# EAGLE design untitled (EAGLE 6.5.0)
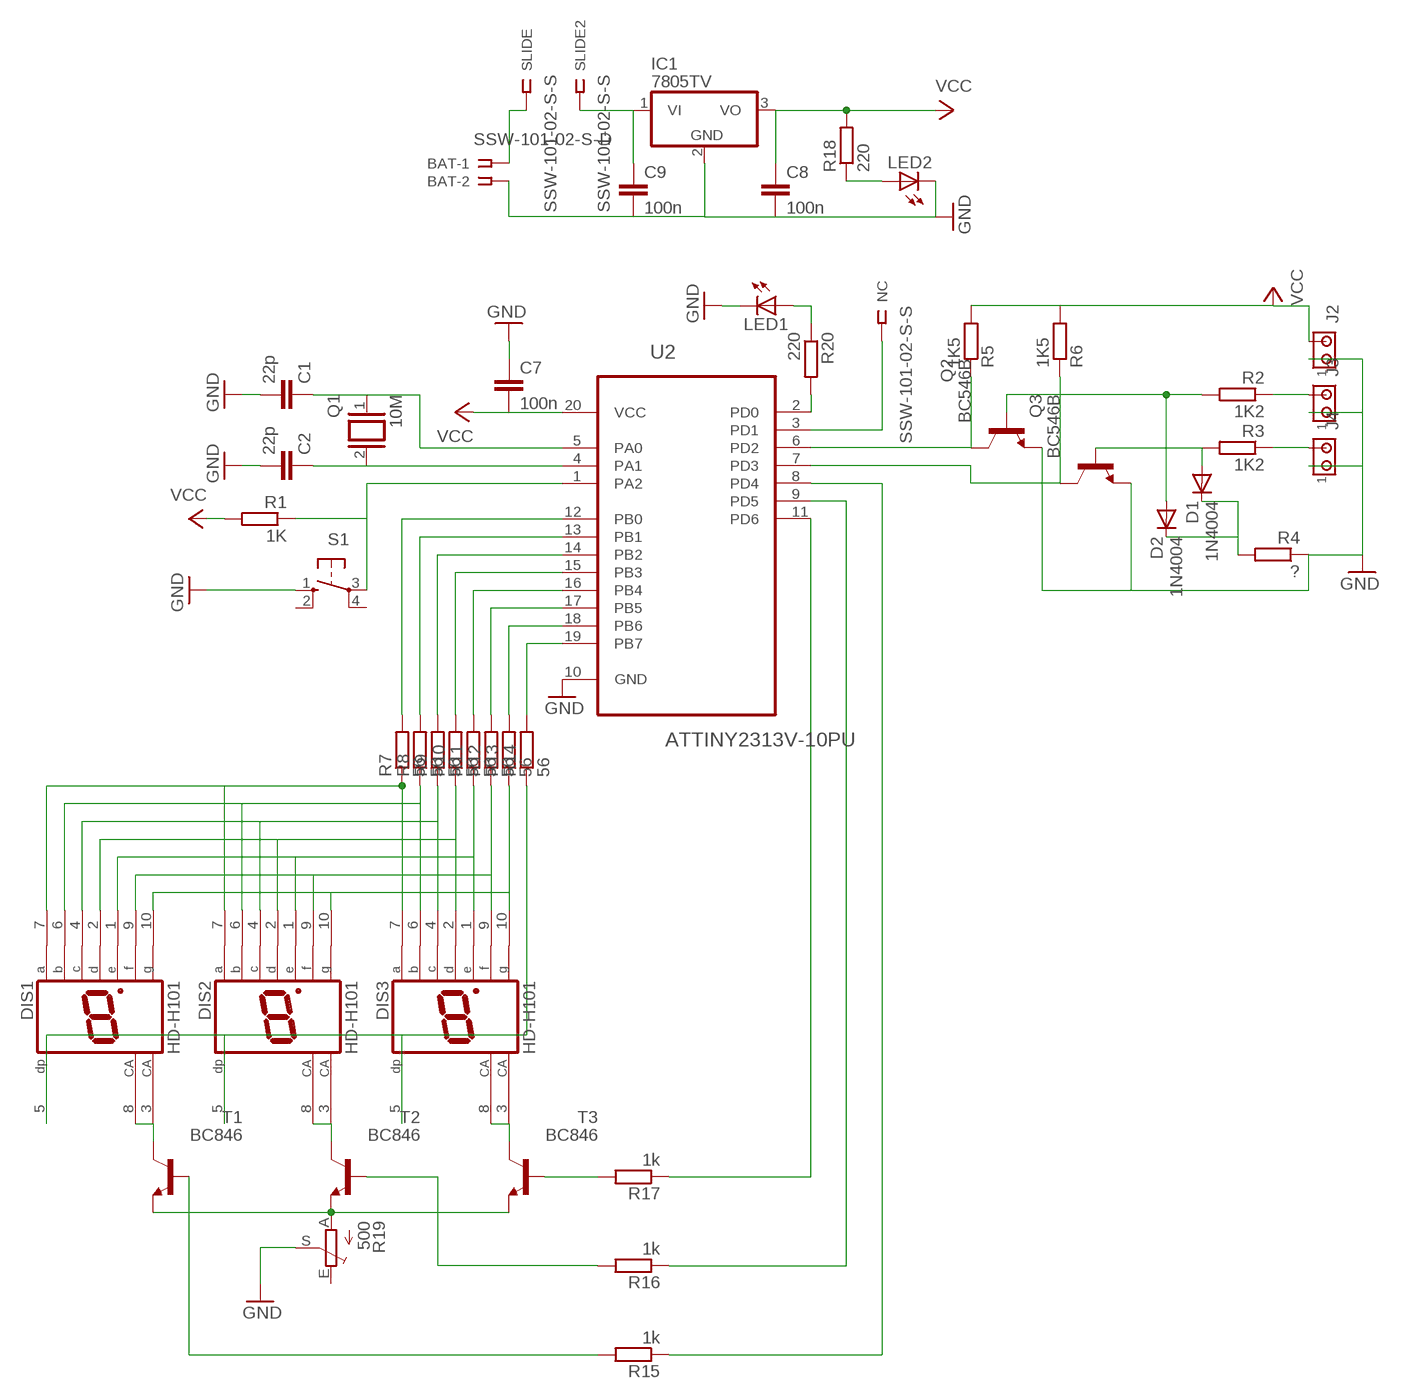
[diagram p0: schematic, sheet 1]

## Parts
BAT  SSW-101-02-S-D  [SSW-101-02-S-D]
C1  22p  C-EU050-024X044  [C050-024X044]
C2  22p  C-EU050-024X044  [C050-024X044]
C7  100n  C-EUC1206  [C1206]
C8  100n  C-EUC1206  [C1206]
C9  100n  C-EUC1206  [C1206]
D1  1N4004  [DO41-10]
D2  1N4004  [DO41-10]
DIS1  HD-H101  [HDSP-M]
DIS2  HD-H101  [HDSP-M]
DIS3  HD-H101  [HDSP-M]
IC1  7805TV  [TO220V]
J2  MTA02-100  [10X02MTA]
J3  MTA02-100  [10X02MTA]
J4  MTA02-100  [10X02MTA]
LED1  LED3MM  [LED3MM]
LED2  LED3MM  [LED3MM]
NC  SSW-101-02-S-S  [SSW-101-02-S-S]
Q1  10M  XTAL/S  [QS]
Q2  BC546B  [TO92-EBC]
Q3  BC546B  [TO92-EBC]
R1  1K  R-EU_0204/7  [0204/7]
R2  1K2  R-EU_0204/7  [0204/7]
R3  1K2  R-EU_0204/7  [0204/7]
R4  ?  R-EU_0204/7  [0204/7]
R5  1K5  R-EU_0204/7  [0204/7]
R6  1K5  R-EU_0204/7  [0204/7]
R7  56  R-EU_M1206  [M1206]
R8  56  R-EU_M1206  [M1206]
R9  56  R-EU_M1206  [M1206]
R10  56  R-EU_M1206  [M1206]
R11  56  R-EU_M1206  [M1206]
R12  56  R-EU_M1206  [M1206]
R13  56  R-EU_M1206  [M1206]
R14  56  R-EU_M1206  [M1206]
R15  1k  R-EU_M1206  [M1206]
R16  1k  R-EU_M1206  [M1206]
R17  1k  R-EU_M1206  [M1206]
R18  220  R-EU_M1206  [M1206]
R19  500  TRIM_EU-CA6V  [CA6V]
R20  220  R-EU_M1206  [M1206]
S1  10-XX  [B3F-10XX]
SLIDE  SSW-101-02-S-S  [SSW-101-02-S-S]
SLIDE2  SSW-101-02-S-S  [SSW-101-02-S-S]
T1  BC846  [SOT23]
T2  BC846  [SOT23]
T3  BC846  [SOT23]
U2  ATTINY2313V-10PU  [DIP254P762X533-20]

## Nets
GND: BAT.2 C1.2 C2.2 C7.1 C8.2 C9.2 IC1.2(GND) J2.1 J3.1 J4.1 LED1.K(C) LED2.K(C) Q2.E Q3.E R4.1 R19.S S1.1(S) U2.10(GND)
N$1: C1.1 Q1.1 U2.5(PA0)
N$2: DIS1.10(G) DIS2.10(G) DIS3.10(G) R13.1
N$3: R1.1 S1.3(P) U2.1(PA2)
N$4: R20.2 U2.2(PD0)
N$5: C9.1 IC1.1(VI) SLIDE2.1
N$6: J3.2 R2.1
N$7: J4.2 R3.1
N$8: D2.A Q2.B R2.2
N$9: D1.A Q3.B R3.2
N$10: D1.C D2.C R4.2
N$11: Q3.C R6.1 U2.7(PD3)
N$12: Q2.C R5.1 U2.6(PD2)
N$13: C2.1 Q1.2 U2.4(PA1)
N$14: DIS1.9(F) DIS2.9(F) DIS3.9(F) R12.1
N$15: DIS1.1(E) DIS2.1(E) DIS3.1(E) R11.1
N$16: DIS1.2(D) DIS2.2(D) DIS3.2(D) R10.1
N$17: DIS1.4(C) DIS2.4(C) DIS3.4(C) R9.1
N$18: DIS1.6(B) DIS2.6(B) DIS3.6(B) R8.1
N$19: DIS1.7(A) DIS2.7(A) DIS3.7(A) R7.1
N$20: R13.2 U2.18(PB6)
N$21: DIS1.5(DP) DIS2.5(DP) DIS3.5(DP) R14.1
N$22: R12.2 U2.17(PB5)
N$23: R11.2 U2.16(PB4)
N$24: R10.2 U2.15(PB3)
N$25: R9.2 U2.14(PB2)
N$26: R8.2 U2.13(PB1)
N$27: R7.2 U2.12(PB0)
N$28: R14.2 U2.19(PB7)
N$29: DIS1.3(CA) DIS1.8(CA) T1.3(C)
N$30: DIS2.3(CA) DIS2.8(CA) T2.3(C)
N$31: DIS3.3(CA) DIS3.8(CA) T3.3(C)
N$32: R19.A T1.2(E) T2.2(E) T3.2(E)
N$33: R16.2 T2.1(B)
N$34: R17.1 U2.11(PD6)
N$35: R16.1 U2.9(PD5)
N$36: R15.1 U2.8(PD4)
N$37: R15.2 T1.1(B)
N$38: R17.2 T3.1(B)
N$39: BAT.1 SLIDE.1
N$40: NC.1 U2.3(PD1)
N$41: LED2.A R18.1
N$42: LED1.A R20.1
VCC: C7.2 C8.1 IC1.3(VO) J2.2 R1.2 R5.2 R6.2 R18.2 U2.20(VCC)
Unconnected: R19.E S1.2(S1) S1.4(P1)

## Library data of the parts
BAT = con-samtec:SSW-101-02-S-D: THROUGH-HOLE .025" SQ POST SOCKET Source: Samtec SSW.pdf; MPN: SSW-101-02-S-D; OC_FARNELL: unknown; OC_NEWARK: 82P1456
C1 C2 C7-C9 = rcl:C-EU: CAPACITOR, European symbol
D1 D2 = diode:1N4004: DIODE general purpose rectifier, 1 A
DIS1-DIS3 = display-hp:HD-H101: LED DISPLAY 1-character 7 segment, decimal point right; OC_FARNELL: unknown; OC_NEWARK: unknown
IC1 = linear:78*: Positive VOLTAGE REGULATOR Source: http://cache.national.com/ds/LM/LM78L05.pdf http://www.fairchildsemi.com/ds/LM/LM7805.pdf
J2-J4 = con-amp:MTA02-100: AMP connector
LED1 LED2 = led:LED: LED OSRAM: - CHIPLED LG R971, LG N971, LY N971, LG Q971, LY Q971, LO R971, LY R971 LH N974, LH R974 LS Q976, LO Q976, LY Q976 LO Q996 - Hyper CHIPLED LW Q18S LB Q993, LB Q99A, LB R99A - SideLED LS A670, LO A670, LY A670, LG A670, LP A670 LB A673, LV A673, LT A673, LW A673 LH A674 LY A675 LS A676, LA A676, LO A676, LY A676, LW A676 LS A679, LY A679, LG A679 - Hyper Micro SIDELED® LS Y876, LA Y876, LO Y876, LY Y876 LT Y87S - SmartLED LW L88C, LW L88S LB L89C, LB L89S, LG L890 LS L89K, LO L89K, LY L89K LS L896, LA L896, LO L896, LY L896 - TOPLED LS T670, LO T670, LY T670, LG T670, LP T670 LSG T670, LSP T670, LSY T670, LOP T670, LYG T670 LG T671, LOG T671, LSG T671 LB T673, LV T673, LT T673, LW T673 LH T674 LS T676, LA T676, LO T676, LY T676, LB T676, LH T676, LSB T676, LW T676 LB T67C, LV T67C, LT T67C, LS T67K, LO T67K, LY T67K, LW E67C LS E67B, LA E67B, LO E67B, LY E67B, LB E67C, LV E67C, LT E67C LW T67C LS T679, LY T679, LG T679 LS T770, LO T770, LY T770, LG T770, LP T770 LB T773, LV T773, LT T773, LW T773 LH T774 LS E675, LA E675, LY E675, LS T675 LS T776, LA T776, LO T776, LY T776, LB T776 LHGB T686 LT T68C, LB T68C - Hyper Mini TOPLED® LB M676 - Mini TOPLED Santana® LG M470 LS M47K, LO M47K, LY M47K Source: http://www.osram.convergy.de LUXEON: - LUMILED® LXK2-PW12-R00, LXK2-PW12-S00, LXK2-PW14-U00, LXK2-PW14-V00 LXK2-PM12-R00, LXK2-PM12-S00, LXK2-PM14-U00 LXK2-PE12-Q00, LXK2-PE12-R00, LXK2-PE12-S00, LXK2-PE14-T00, LXK2-PE14-U00 LXK2-PB12-K00, LXK2-PB12-L00, LXK2-PB12-M00, LXK2-PB14-N00, LXK2-PB14-P00, LXK2-PB14-Q00 LXK2-PR12-L00, LXK2-PR12-M00, LXK2-PR14-Q00, LXK2-PR14-R00 LXK2-PD12-Q00, LXK2-PD12-R00, LXK2-PD12-S00 LXK2-PH12-R00, LXK2-PH12-S00 LXK2-PL12-P00, LXK2-PL12-Q00, LXK2-PL12-R00 Source: www.luxeon.com KINGBRIGHT: KA-3528ASYC Source: www.kingbright.com
NC SLIDE SLIDE2 = con-samtec:SSW-101-02-S-S: THROUGH-HOLE .025" SQ POST SOCKET Source: Samtec SSW.pdf; MPN: SSW-101-02-S-S; OC_FARNELL: unknown; OC_NEWARK: 11P9336
Q1 = special:XTAL/S: CRYSTAL
Q2 Q3 = transistor-npn:BC546*: NPN Transistor
R1-R18 R20 = rcl:R-EU_: RESISTOR, European symbol
R19 = pot:TRIM_EU-: POTENTIOMETER
S1 = switch-omron:10-XX: OMRON SWITCH; MPN: B3F-1000; OC_FARNELL: 176432; OC_NEWARK: 36M3542
T1-T3 = transistor:BC846: NPN TRANSISTOR
U2 = Atmel_By_element14_Batch_1-00:ATTINY2313V-10PU: Microcontroller; MPN: ATTINY2313V-10PU; OC_FARNELL: 9171614; OC_NEWARK: 01M6916; PACKAGE: DIP-20; SUPPLIER: ATMEL

## Board
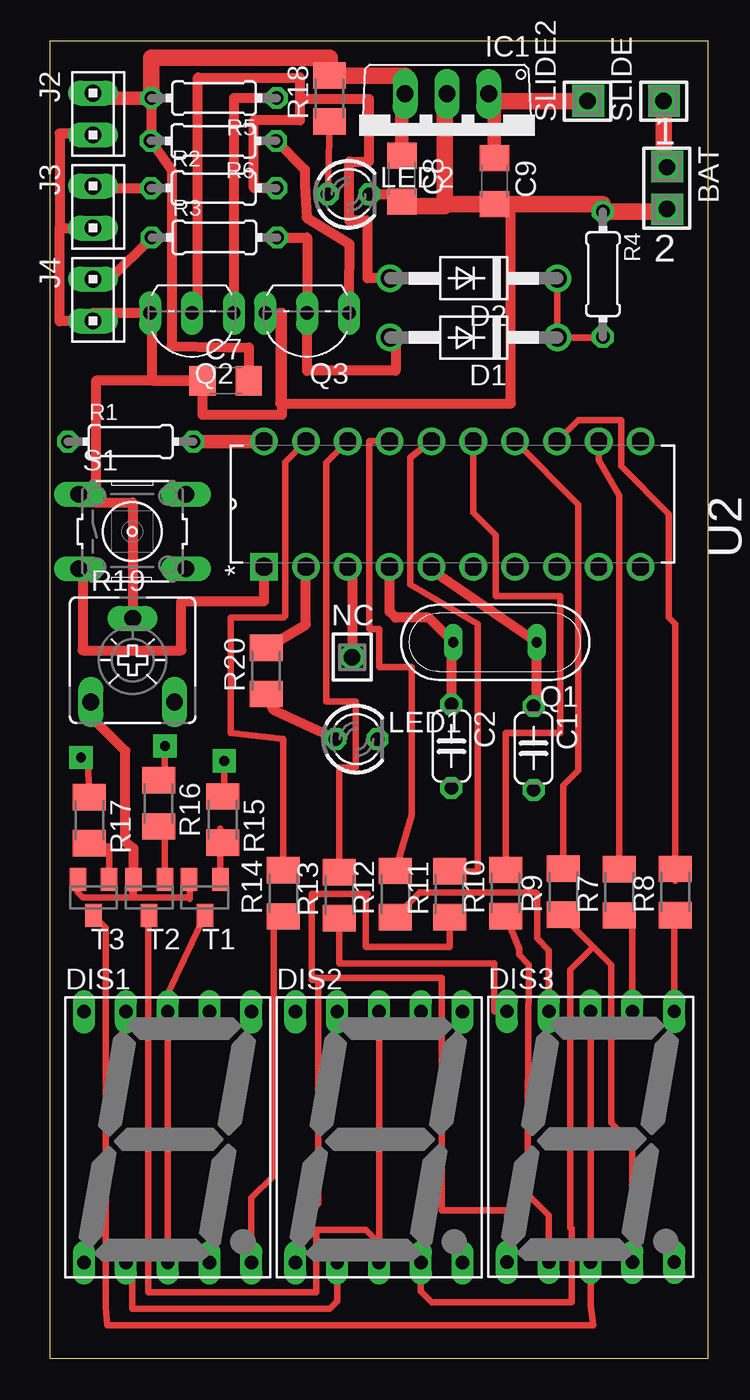
[diagram p1: board, top side]
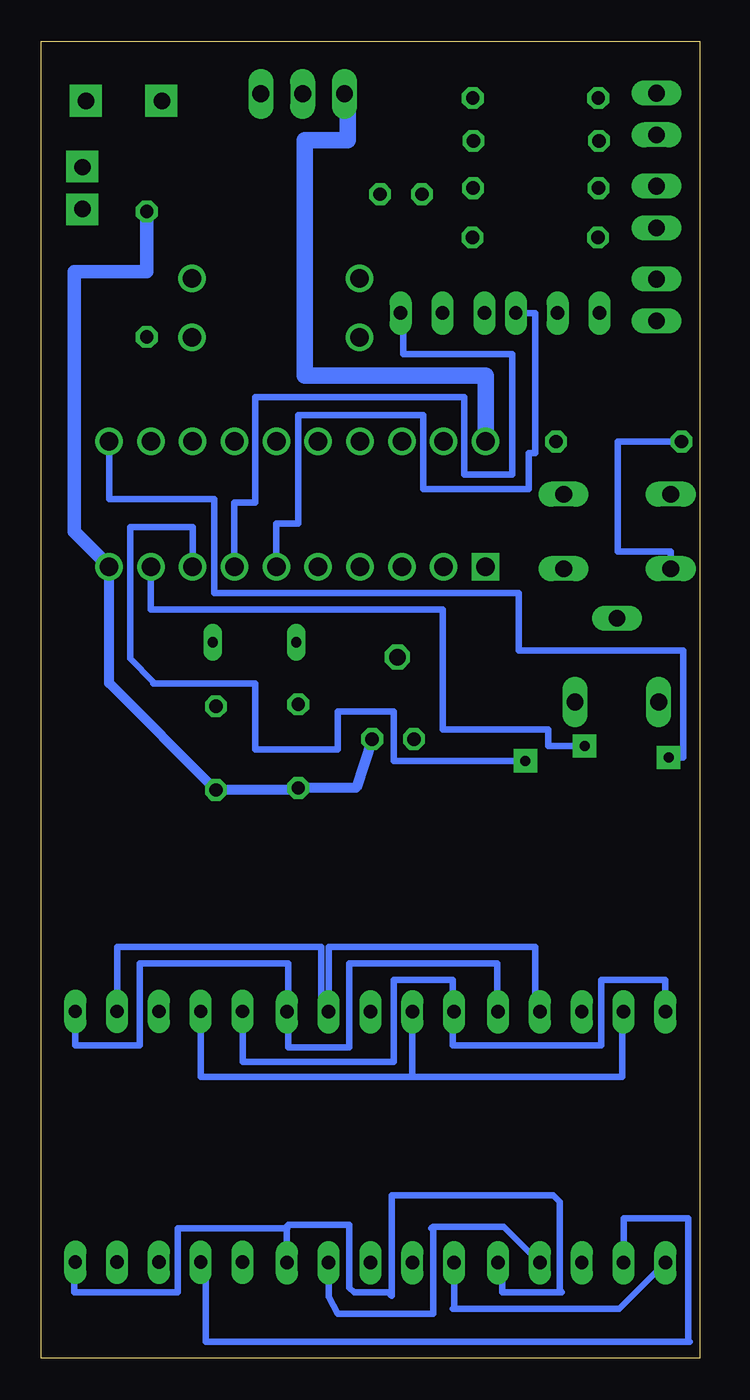
[diagram p2: board, bottom side, seen from below]

Size 40 x 80 mm. Coordinates in mm from the lower left corner, seen from the top.
Outline: 0,0 40,0 40,80 0,80 0,0
Copper layers (1*16): Top 0.035mm / dielectric 1.5mm / Bottom 0.035mm
Design rules "default": minimum track width 10mil, minimum drill 24mil, track to track 8mil, track to pad 8mil, pad to pad 8mil, via to via 8mil, smd to smd 8mil, copper to edge 40mil, drill to drill 8mil, minimum pad ring 10mil, minimum via ring 8mil, stop-mask expansion 4mil, vias tented up to drill 0mil, thermal gap 10mil

### Footprints (pad centres in the part's own frame; a part is rotated, then mirrored left to right if it is on the bottom)
SSW-101-02-S-D = drill 1 pad 1.5 octagon: 1 0,-1.27; 2 0,1.27
C050-024X044 = drill 0.813 octagon: 1 -2.54,0; 2 2.54,0
C1206 = smd 1.6 x 1.8: 1 -1.4,0; 2 1.4,0
DO41-10 = drill 1.118: A 5.08,0; C -5.08,0
HDSP-M = drill 0.813 long: 1 -5.08,-7.62; 2 -2.54,-7.62; 3 0,-7.62; 4 2.54,-7.62; 5 5.08,-7.62; 6 5.08,7.62; 7 2.54,7.62; 8 0,7.62; 9 -2.54,7.62; 10 -5.08,7.62
TO220V = drill 1.016 long: 1 -2.54,-2.54; 2 0,-2.54; 3 2.54,-2.54
10X02MTA = drill 1.016 long: 1 1.27,0; 2 -1.27,0
LED3MM = drill 0.813 octagon: A -1.27,0; K 1.27,0
SSW-101-02-S-S = drill 1 pad 1.5 octagon: 1 0,0
QS = drill 0.61 long: 1 -2.54,0; 2 2.54,0
TO92-EBC = drill 0.813 long: B 0,-1.27; C -2.54,-1.27; E 2.54,-1.27
0204/7 = drill 0.813 octagon: 1 -3.81,0; 2 3.81,0
M1206 = smd 1.6 x 2: 1 -1.4,0; 2 1.4,0
CA6V = drill 1.016 long: A -2.54,-2.54; E 2.54,-2.54; S 0,2.54
B3F-10XX = drill 1.016 long: 1 -3.251,2.261; 2 3.251,2.261; 3 -3.251,-2.261; 4 3.251,-2.261
SOT23 = smd 1 x 1.4: 1 -0.95,-1.1; 2 0.95,-1.1; 3 0,1.1
DIP254P762X533-20 = drill 1.118 square: 1 -7.62,22.86 | drill 1.118: 2 -7.62,20.32; 3 -7.62,17.78; 4 -7.62,15.24; 5 -7.62,12.7; 6 -7.62,10.16; 7 -7.62,7.62; 8 -7.62,5.08; 9 -7.62,2.54; 10 -7.62,0; 11 0,0; 12 0,2.54; 13 0,5.08; 14 0,7.62; 15 0,10.16; 16 0,12.7; 17 0,15.24; 18 0,17.78; 19 0,20.32; 20 0,22.86

### Placement (x,y rotation side)
BAT  37.48,71.09 180 top
C1  29.39,37.07 270 top
C2  24.39,37.19 270 top
C7  10.69,59.39 0 top
C8  21.39,71.66 270 top
C9  27.01,71.51 270 top
D1  25.75,62.01 180 top
D2  25.75,65.61 180 top
DIS1  7.17,13.43 0 top
DIS2  20,13.43 0 top
DIS3  32.85,13.46 0 top
IC1  24.12,74.28 180 top
J2  2.63,75.59 270 top
J3  2.63,69.94 270 top
J4  2.63,64.29 270 top
LED1  18.63,37.62 0 top
LED2  18.15,70.72 0 top
NC  18.37,42.6 270 top
Q1  27.05,43.5 180 top
Q2  8.64,62.23 180 top
Q3  15.63,62.23 180 top
R1  4.92,55.69 0 top
R2  9.96,71.09 0 top
R3  10,68.09 0 top
R4  33.59,65.86 270 top
R5  9.98,76.56 180 top
R6  9.94,73.96 180 top
R7  34.59,28.31 90 top
R8  37.99,28.33 90 top
R9  31.19,28.35 90 top
R10  27.69,28.27 90 top
R11  24.29,28.19 90 top
R12  20.99,28.21 90 top
R13  17.59,28.13 90 top
R14  14.19,28.25 90 top
R15  10.51,32.73 270 top
R16  6.61,33.71 270 top
R17  2.41,32.69 270 top
R18  16.99,76.53 90 top
R19  5.04,42.41 0 top
R20  13.14,41.76 90 top
S1  5.02,50.23 0 top
SLIDE  37.28,76.37 0 top
SLIDE2  32.66,76.37 0 top
T1  9.42,28 180 top
T2  6.04,28 180 top
T3  2.66,28 180 top
U2  35.88,55.71 90 top

### Tracks (layer width: path | path; a pad name or v marks a point on that pad's centre or on a via)
GND
  Top 0.61: J2.1 2.63,74.4 0.6,74.4 0.6,68.67 | 0.6,68.67 J3.1 | 0.6,68.67 0.6,63 2.63,63 J4.1 2.63,63.5 Q2.E 6.2,63.5 6.2,59.4 C7.1 | LED2.K 21.39,70.72 C8.2 | C7.1 2.8,59.39 2.8,52 | 2.8,52 1.77,52 S1.1 | Q3.E 14,63.5 | C7.1 9.29,57.3 14.1,57.3 14.1,63.5 14,63.5 | 14,63.5 14,58 28,58 28,70.11 | 2.8,52 5.04,52 R19.S
  Top 1.016: IC1.2 24,76.82 24,70.11 | C8.2 21.39,70 24,70 24,70.11 | 24,70.11 C9.2 28,70.11 33.59,70.11 R4.1 37.48,69.67 BAT.2
  Bottom 0.61: U2.10 35.88,41.02 C1.2 24.51,34.53 C2.2 20.87,34.65 LED1.K
  Bottom 0.813: U2.10 38,50.21 38,66 33.59,66 R4.1
N$1
  Top 0.61: U2.5 23.77,47.5 Q1.1 29.59,39.81 C1.1
N$2
  Top 0.406: R13.1 17.59,24 27,24 27,21.08 DIS3.10
  Bottom 0.406: DIS3.10 27.77,18 18.6,18 18.6,23 15,23 15,21.05 | DIS1.10 2.09,23 6,23 6,19 15,19 15,21.05 | 15,21.05 DIS2.10
N$3
  Top 0.61: S1.3 2,47.97 2,43 8,43 8,46 13.02,46 U2.1
  Bottom 0.406: R1.1 5,55.69 5,49 1.77,49 S1.3
N$4
  Top 0.61: R20.2 15.56,44.58 U2.2
N$5
  Top 0.813: C9.1 27.01,76.82 IC1.1
  Top 1.016: IC1.1 26.66,76.37 SLIDE2.1
N$6
  Top 0.61: J3.2 2.63,71.09 R2.1
N$7
  Top 0.61: J4.2 3.66,65.56 R3.1
N$8
  Top 0.61: R2.2 12.4,71.09 12.4,75.2 15.2,75.2 15.2,76.5 | Q2.B 9,63.5 9,77.8 15.2,77.8 15.2,76.5 | D2.A 19.3,65.61 19.3,69.1 18.2,69.1 18.2,72.7 19.4,72.7 19.4,76.5 15.2,76.5
N$9
  Top 0.61: R3.2 15.63,68.09 Q3.B 15.63,60 21,60 21,62.01 D1.A
N$10
  Top 0.406: D2.C D1.C 33.59,62.01 R4.2
N$11
  Top 0.61: R6.1 15.5,72.21 15.5,71.3 15.6,69.3 18.2,67.7 18.17,64.6 Q3.C
  Bottom 0.406: Q3.C 18,63.5 18,61 11.4,61 11.4,53.7 14.3,53.7 14.3,58.4 27,58.4 27,52 28.26,52 U2.7
N$12
  Top 0.61: R5.1 11.18,76.56 Q2.C
  Bottom 0.406: Q2.C 10,63.5 10,55 10.4,55 10.4,52.8 16.8,52.8 16.8,57.3 24.4,57.3 24.4,50.7 25.72,50.7 U2.6
N$13
  Top 0.61: U2.4 20.64,45.36 21,45 23.01,45 Q1.2 24.39,43.38 C2.1
N$14
  Top 0.406: R12.1 22.48,28.3 29.5,28.3 29.6,28.2 29.6,25.5 30.31,24.79 DIS3.9
  Bottom 0.406: 17.46,17.1 30.3,17.1 DIS3.9 | DIS2.9 17.46,17.1 | 17.46,17.1 4.7,17.1 4.7,21.05 DIS1.9
N$15
  Top 0.406: R11.1 24.29,25 19.2,25 19.2,28.2 | 19.2,28.2 19.3,28.2 | 19.2,28.2 15.9,28.2 15.9,23 16,23 | 16,23 16.3,23 16.3,9.4 14.92,8.02 DIS2.1 | DIS3.1 27.77,7.77 27.8,9 23.8,9 23.8,23.1 16,23.1 16,23
  Bottom 0.406: DIS1.1 4.9,3 15,3 14.92,3.08 DIS2.1
N$16
  Top 0.406: R10.1 28.5,24.86 28.5,24.5 29.1,23.9 29,10 30.31,8.69 DIS3.2 | DIS1.2 5,5.44 5,3 17,3 17.46,3.46 DIS2.2
  Bottom 0.406: DIS3.2 30,5.53 30,1 0.6,1 0.7,1.1 0.7,8.5 4.63,8.5 DIS1.2
N$17
  Top 0.406: R9.1 31.19,26.81 33,25 | 33,25 34.1,23.9 34.1,14.3 35.39,13.01 DIS3.4 | DIS2.4 22.54,4.06 23.2,3.4 31.7,3.4 31.7,7.9 31.6,7.9 31.6,23.6 33,25
  Bottom 0.406: DIS1.4 11.9,8 16.2,8 | 16.3,7.9 16.2,8 | 16.2,8 16.2,2.7 22,2.7 22.54,3.74 DIS2.4
N$18
  Top 0.406: R8.1 37.93,26.93 DIS3.6
  Bottom 0.406: DIS3.6 37.93,19 34,19 34,24 25,24 25,21.05 | 25,21.05 DIS2.6 | 25,21.05 25,18.9 21.3,18.9 21.3,24 12.3,24 12.3,21.05 DIS1.6
N$19
  Top 0.406: R7.1 35.39,26.91 DIS3.7
  Bottom 0.406: DIS3.7 35.39,25 23,25 23,21.05 DIS2.7 22.54,25 10,25 10,21.05 DIS1.7
N$20
  Top 0.406: U2.18 16.8,54.41 16.8,39.9 18.6,39.9 18.6,35.9 17.59,35.9 R13.2
N$21
  Top 0.406: R14.1 13.6,26.26 13.6,11.1 12.25,9.75 DIS1.5
  Bottom 0.406: DIS1.5 12,5.56 12,4 8.4,4 8.5,4.1 8.5,9.5 8.9,9.9 18.7,9.9 18.7,3.8 18.9,4 21,4 21.3,4.3 21.3,8.1 25,8.1 25.05,8.05 | 25.05,8.05 25.08,8.02 DIS2.5 | DIS3.5 38,5.84 38,4 31.7,4 31.7,7.9 25.05,7.9 25.05,8.05
N$22
  Top 0.406: U2.17 19.4,55.71 19.4,44.3 20,44.3 20,42 22,42 22,41 | 21.99,41 22,41 | 22,41 22,33 R12.2
N$23
  Top 0.406: R11.2 26,29.59 26,44.6 21.9,47 21.9,54.73 U2.16
N$24
  Top 0.406: R10.2 27.69,38 31,38 31,46.3 27.1,46.3 27.1,50 25.72,51.38 U2.15
N$25
  Top 0.406: U2.14 32.1,51.87 32.1,35.7 31.19,34.79 R9.2
N$26
  Top 0.406: U2.13 32.09,57 34.7,57 34.7,54.2 37.6,51.3 37.6,45 38,44.6 38,29 37.99,29.01 R8.2
N$27
  Top 0.406: R7.2 34.6,52.4 33.34,54.56 U2.12
N$28
  Top 0.406: U2.19 14.3,54.45 14.3,45.1 14.2,45 11,45 11,38 14.19,37.61 R14.2
N$29
  Top 0.406: T1.3 7.17,22.15 DIS1.8 DIS1.3
N$30
  Top 0.406: DIS2.8 DIS2.3 20,7 19.2,7.8 16.2,7.8 16.2,4 6,4 6,26.86 T2.3
N$31
  Top 0.406: DIS3.8 DIS3.3 32.85,3.15 33,2 3.5,2 3.4,3.1 3.4,26.16 T3.3
N$32
  Top 0.406: T1.2 8.5,29.07 8.5,27.9 8.4,28 5,28 | 5,28 5.09,28.09 T2.2 5,29.01 5,28 | 5,28 2,28 1.71,28.29 T3.2 | 5.09,31 5,31 | 2.63,38.87 R19.A
  Top 0.61: T2.2 5.09,31 | 5,31 4.6,31.4 4.6,36.9 2.63,38.87
N$33
  Top 0.406: R16.2 6.99,31.93 T2.1
N$34  (via drill 0.6 pad 1.42)
  Top 0.406: R17.1 2.31,36.5 v1.9,36.5
  Bottom 0.406: v1.9,36.5 1,36.5 1,43 11,43 11,46.5 29.5,46.5 29.5,52.2 35.88,52.2 U2.11
N$35  (via drill 0.6 pad 1.42)
  Top 0.406: R16.1 7,35.11 v7,37.2
  Bottom 0.406: v7,37.2 9.2,37.2 9.2,38.2 15.6,38.2 15.6,45.5 33.34,45.5 U2.9
N$36  (via drill 0.6 pad 1.42)
  Top 0.406: R15.1 10.6,34.13 v10.6,36.3
  Bottom 0.406: v10.6,36.3 18.6,36.3 18.6,39.3 22,39.3 22,37 27,37 27,41 33.2,41 33.2,41.1 34.6,42.5 34.6,50.5 30.8,50.5 U2.8
N$37
  Top 0.406: R15.2 10.37,32.19 T1.1
N$38
  Top 0.406: R17.2 3.61,31.09 T3.1
N$39
  Top 1.016: SLIDE.1 37.28,72.36 BAT.1
N$40
  Top 0.61: U2.3 18.37,48.09 NC.1
N$41
  Top 0.406: R18.1 17.02,75.13 LED2.A
N$42
  Top 0.61: LED1.A 13.62,39.36 R20.1
N$43  (via drill 0.7 pad 1.93)
  other vias: 32.7,76.4
N$44  (via drill 0.7 pad 1.93)
  other vias: 37.3,76.4
N$45  (via drill 0.6 pad 1.93)
  other vias: 37.5,72.4 37.5,69.8
VCC
  Top 0.406: J2.2 2.63,76.56 | 13.02,55.69 U2.20
  Top 0.61: R5.2 6.17,73.96 R6.2 7.4,72.19 7.4,61.5 12.09,61.4 C7.2
  Top 0.813: 2.63,76.56 R5.2 | C8.1 21.39,76.82 IC1.3 | R1.2 13.02,55.69
  Top 1.016: R5.2 6.17,79 17,79 R18.2 21.58,77.93 IC1.3
  Bottom 1.016: U2.20 13,55.71 13,59.7 24,59.7 24,74 21.39,74 21.39,76 21.58,76 IC1.3